# EasyEDA Pro project ESP32_S3.epro

# Schematic Schematic1
Board Name: Board1; Create Date: 2025-04-27; Page Name: P1; Project Name: ESP32S3; Schematic Name: Schematic1; Update Date: 2025-04-27; Company: EasyEDA.com; Page Size: A4; Version: V1.0
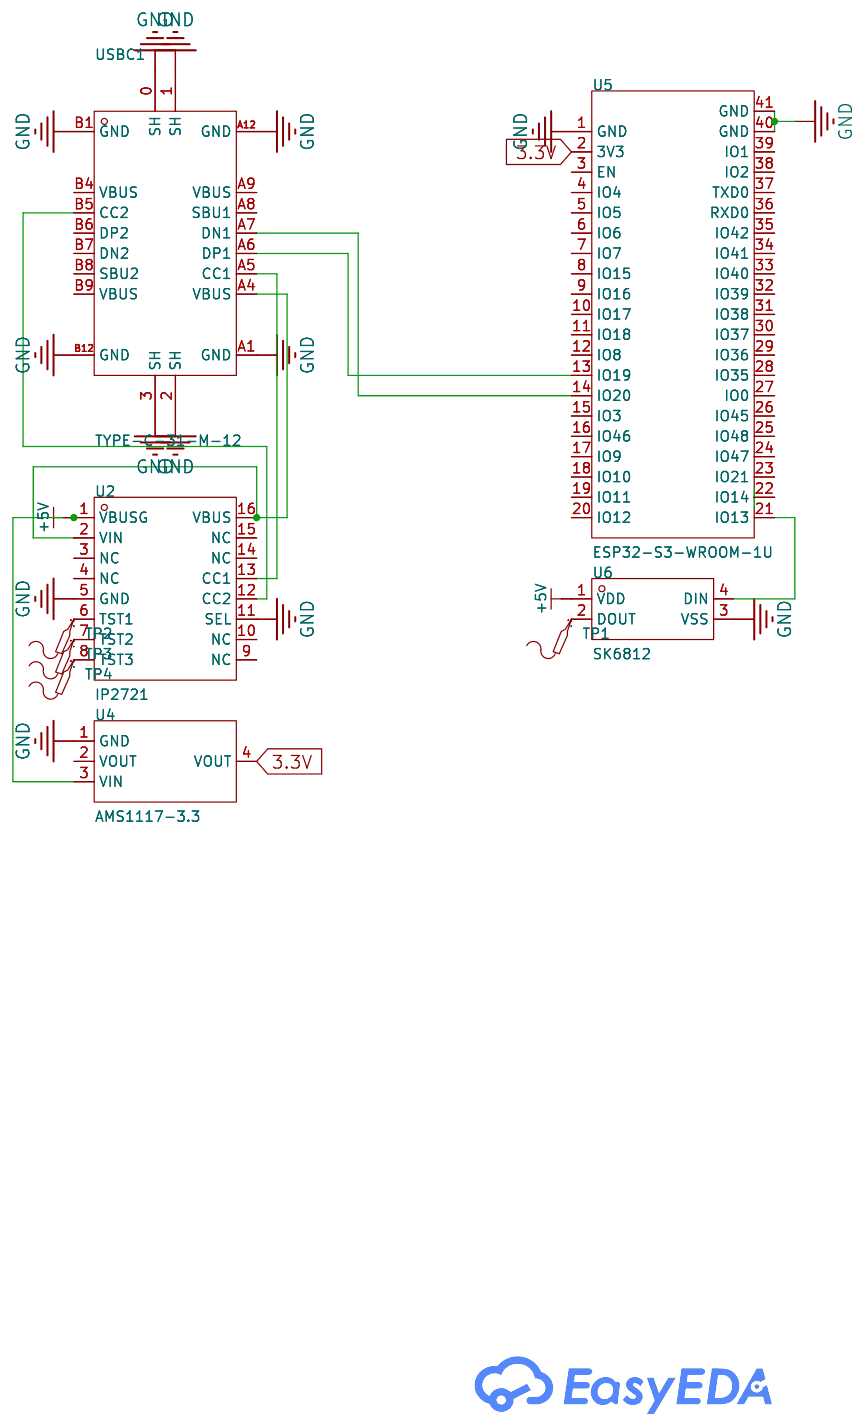
[diagram p0: schematic sheet]

## Parts
TP1  -  [Test-Point-0.5mm]
TP2  -  [Test-Point-0.5mm]
TP3  -  [Test-Point-0.5mm]
TP4  -  [Test-Point-0.5mm]
U2  IP2721  [TSSOP-16_L5.0-W4.4-P0.65-LS6.4-BL]
U4  AMS1117-3.3  [SOT-223-3_L6.5-W3.4-P2.30-LS7.0-BR]
U5  ESP32-S3-WROOM-1U  [WIRELM-SMD_ESP32-S3-WROOM-1U]
U6  SK6812  [LED-SMD_4P-L5.0-W5.0-TL]
USBC1  TYPE-C-31-M-12  [USB-C_SMD-TYPE-C-31-M-12]

## Library data of the parts
TP1-TP4 = Test-Point: Test Point 测试点
U2 = IP2721: LCSC Part Name: USB TYPEC/PD2.0/PD3.0物理层IC; Supplier Part: C603176; Manufacturer: INJOINIC(英集芯); Supplier Footprint: TSSOP-16; JLCPCB Part Class: Extended Part; Datasheet: https://atta.szlcsc.com/upload/public/pdf/source/20200610/C603176_729C2C55A9E6451BDA9FCB913350E23E.pdf; Supplier: LCSC
U4 = AMS1117-3.3_C6186: Output Type:Fixed Voltage - Supply:- Output Voltage:3.3V Output Voltage:3.3V Output Current:1A Power Supply Rejection Ratio (PSRR):72dB@(120Hz) Voltage Dropout:1.3V@(800mA) standby current:- Noise:- Features:Overcurrent Protection(OCP)；热关断(TSD) Operating; LCSC Part Name: 输出3.3V 1A; Supplier Part: C6186; Manufacturer: AMS; Supplier Footprint: SOT-223; Datasheet: https://atta.szlcsc.com/upload/public/pdf/source/20180727/C6186_7A095716F0823C02F1997A905E26C086.pdf; Supplier: LCSC; Output Type: Fixed; Output Voltage: 3.3V; Output Current: 1A; Power Supply Rejection Ratio (PSRR): 72dB@(120Hz); Voltage Dropout: 1.3V@(800mA); Features: Overcurrent Protection(OCP)；热关断(TSD); Output Configuration: Positive electrode; Number of Outputs: 1
U5 = ESP32-S3-WROOM-1U: Supplier Part: C9900027631; JLCPCB Part Class: Extended Part; Supplier: LCSC
U6 = SK6812: Supplier Part: C2765348; Supplier Footprint: SMD-4P,2.0x4; Supplier: LCSC
USBC1 = TYPE-C-31-M-12: Connector Type:Type-C Standard:- Gender:Female Mounting Style:- Number of Contacts:16P Number of Ports:1 Current Rating - Power (Max):5A Operating Temperature Range:- Operating Temperature Range:-; LCSC Part Name: Type-C 母; Supplier Part: C165948; Manufacturer: 韩国韩荣; Supplier Footprint: SMD; Datasheet: https://atta.szlcsc.com/upload/public/pdf/source/20220525/466408E853115E789EDB0DDC29077C05.pdf; Supplier: LCSC; Connector Type: Type-C; Gender: Female; Number of Contacts: 16P; Number of Ports: 1; Current Rating - Power (Max): 5A

## Nets
3.3V: U4.4(VOUT) U5.2(3V3)
+5V: U2.1(VBUSG) U4.3(VIN) U6.1(VDD)
GND: U2.5(GND) U2.11(SEL) U4.1(GND) U5.1(GND) U5.40(GND) U5.41(GND) U6.3(VSS) USBC1.0(SH) USBC1.1(SH) USBC1.2(SH) USBC1.3(SH) USBC1.A1(GND) USBC1.A12(GND) USBC1.B1(GND) USBC1.B12(GND)
Net-(TP1-1): TP1.1 U6.2(DOUT)
Net-(TP2-1): TP2.1 U2.6(TST1)
Net-(TP3-1): TP3.1 U2.7(TST2)
Net-(TP4-1): TP4.1 U2.8(TST3)
Net-(U2-2): U2.2(VIN) U2.16(VBUS) USBC1.A4(VBUS)
Net-(U2-12): U2.12(CC2) USBC1.B5(CC2)
Net-(U2-13): U2.13(CC1) USBC1.A5(CC1)
Net-(U5-13): U5.13(IO19) USBC1.A6(DP1)
Net-(U5-14): U5.14(IO20) USBC1.A7(DN1)
Net-(U5-21): U5.21(IO13) U6.4(DIN)

Not connected (* = marked no-connect by the designer): U2 3(NC) 4(NC) 9(NC) 10(NC) 14(NC) 15(NC); U4 2(VOUT); U5 3(EN) 4(IO4) 5(IO5) 6(IO6) 7(IO7) 8(IO15) 9(IO16) 10(IO17) 11(IO18) 12(IO8) 15(IO3) 16(IO46) 17(IO9) 18(IO10) 19(IO11) 20(IO12) 22(IO14) 23(IO21) 24(IO47) 25(IO48) 26(IO45) 27(IO0) 28(IO35) 29(IO36) 30(IO37) 31(IO38) 32(IO39) 33(IO40) 34(IO41) 35(IO42) 36(RXD0) 37(TXD0) 38(IO2) 39(IO1); USBC1 A8(SBU1) A9(VBUS) B4(VBUS) B6(DP2) B7(DN2) B8(SBU2) B9(VBUS)
